# Altium schematic sheet DAC_Interface.SchDoc
size A3; PageSetup: Record=PageOptions|CenterHorizontal=True|CenterVertical=True|PrintScale=0.71|XCorrection=1.00|YCorrection=1.00|PrintKind=0|BorderSize=5000000|LeftOffset=0|BottomOffset=0|Orientation=2|PaperLength=1000|PaperWidth=1000|Scale=100|PaperSource=7|PrintQuality=-4|MediaType=1|DitherType=10|PaperKind=A4|PrintScaleMode=1; Date: 27.05.2014; DrawnBy: luths8; Organization: BFH; Address1: Bern University of Applied Sciences; Address2: Engineering and Information Technology; Address3: Jlcoweg 1; Address4: CH-3400 Burgdorf; DocumentNumber: 3; Revision: 1.1; SheetNumber: 3; SheetTotal: 5; CurrentDate: 27.05.2014
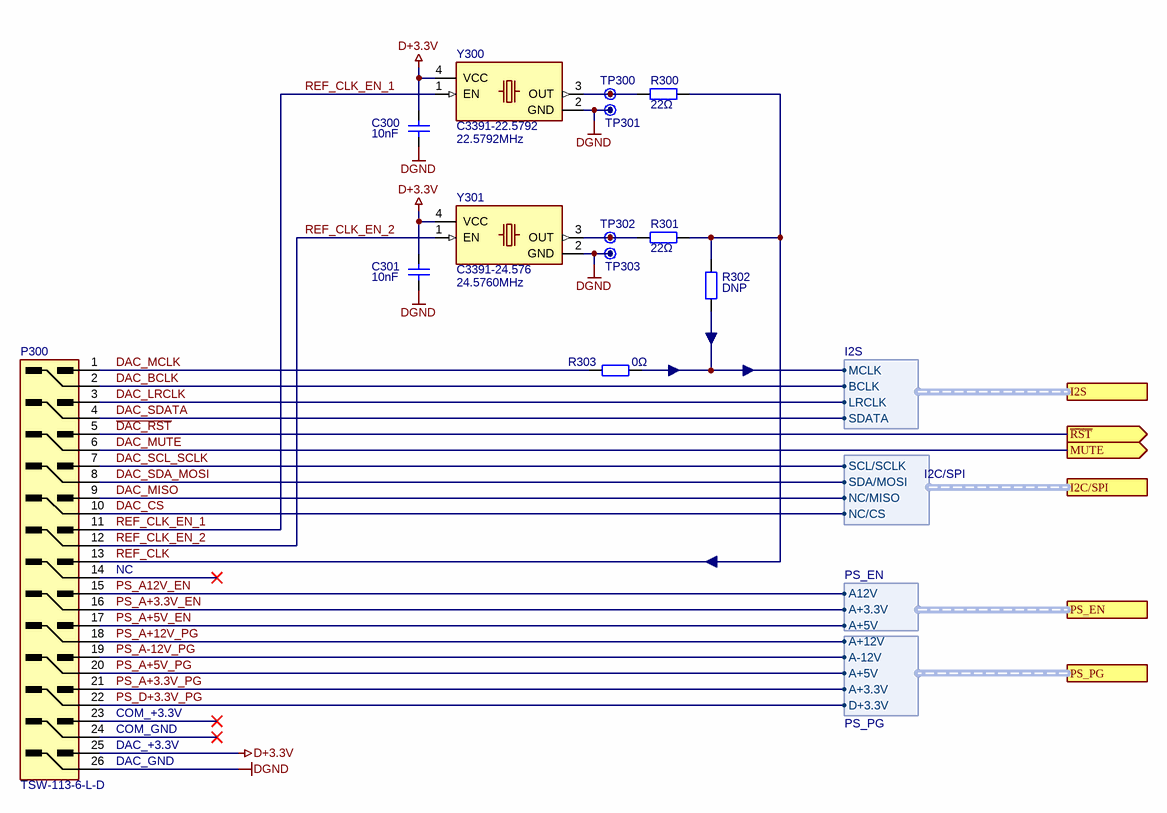
[diagram p0: DAC_Interface.SchDoc]

## Parts
C300  10nF  [SMD0603CAP]
C301  10nF  [SMD0603CAP]
P300  TSW-113-6-L-D  [HEADER_2x13P_VERTICAL]
R300  22Ω  [SMD0603RES]
R301  22Ω  [SMD0603RES]
R302  DNP  [SMD0603RES]
R303  0Ω  [SMD0603RES]
TP300  Testpoint  [TP]  (value not drawn)  (no BOM)
TP301  Testpoint  [TP]  (value not drawn)  (no BOM)
TP302  Testpoint  [TP]  (value not drawn)  (no BOM)
TP303  Testpoint  [TP]  (value not drawn)  (no BOM)
Y300  C3391-22.5792  Frequency: 22.5792MHz  [OSC_CRYSTEK]
Y301  C3391-24.576  Frequency: 24.5760MHz  [OSC_CRYSTEK]

## Ports
I2C/SPI (harness I2C/SPI), I2S (harness I2S), MUTE (out), PS_EN (harness PS_EN), PS_PG (harness PS_PG), ~{RST} (out)

## Harnesses
PS_EN: A12V, A+3.3V, A+5V
PS_PG: A+12V, A-12V, A+3.3V, A+5V, D+3.3V
I2S: MCLK, BCLK, LRCLK, SDATA
I2C/SPI: SCL/SCLK, SDA/MOSI, NC/MISO, NC/CS

## Nets
D+3.3V: C300.1 C301.1 P300.25 Y300.4(VCC) Y301.4(VCC)
DGND: C300.2(q) C301.2(q) P300.26 TP301.1 TP303.1 Y300.2(GND) Y301.2(GND)
~{DAC_RST}: P300.5 ; port ~{RST}
DAC_BCLK: P300.2 ; port I2S.BCLK
DAC_CS: P300.10 ; port I2C/SPI.NC/CS
DAC_LRCLK: P300.3 ; port I2S.LRCLK
DAC_MCLK: P300.1 R303.2
DAC_MISO: P300.9 ; port I2C/SPI.NC/MISO
DAC_MUTE: P300.6 ; port MUTE
DAC_SCL_SCLK: P300.7 ; port I2C/SPI.SCL/SCLK
DAC_SDA_MOSI: P300.8 ; port I2C/SPI.SDA/MOSI
DAC_SDATA: P300.4 ; port I2S.SDATA
PS_A12V_EN: P300.15 ; port PS_EN.A12V
PS_A+3.3V_EN: P300.16 ; port PS_EN.A+3.3V
PS_A+3.3V_PG: P300.21 ; port PS_PG.A+3.3V
PS_A+5V_EN: P300.17 ; port PS_EN.A+5V
PS_A+5V_PG: P300.20 ; port PS_PG.A+5V
PS_A+12V_PG: P300.18 ; port PS_PG.A+12V
PS_A-12V_PG: P300.19 ; port PS_PG.A-12V
PS_D+3.3V_PG: P300.22 ; port PS_PG.D+3.3V
REF_CLK: P300.13 R300.2 R301.2 R302.1
REF_CLK_EN_1: P300.11 Y300.1(EN)
REF_CLK_EN_2: P300.12 Y301.1(EN)
NetR300_1: R300.1 TP300.1 Y300.3(OUT)
NetR301_1: R301.1 TP302.1 Y301.3(OUT)
NetR302_2: R302.2 R303.1 ; port I2S.MCLK

Not connected (* = marked no-connect by the designer): P300 14* 23* 24*

## Notes on the sheet
- (near P300) NC
- (near P300) COM_+3.3V
- (near P300) COM_GND
- (near P300) DAC_GND
- (near P300) DAC_+3.3V
- Project:
- Size:
- Sheet:
- Title:
- A3
- of
- Drawn by:
- Revision:
- Date:
- Variant:
- b
- File:

## Library data of the parts
C300 C301 = Capacitor Ceramic: Ceramic Capacitor; Voltage: *; Manufacturer Part No.: *
P300 = Header 13x2P: Manufacturer Part No.: TSW-113-6-L-D
R300-R303 = Resistor: Manufacturer Part No.: *
Y300 Y301 = Oscillator Crystek: HCMOS Oscillator
  Y300: Manufacturer Part No.: C3391-22.5792
  Y301: Manufacturer Part No.: C3391-24.576
TP300-TP303 = Testpoint: Manufacturer Part No.: *